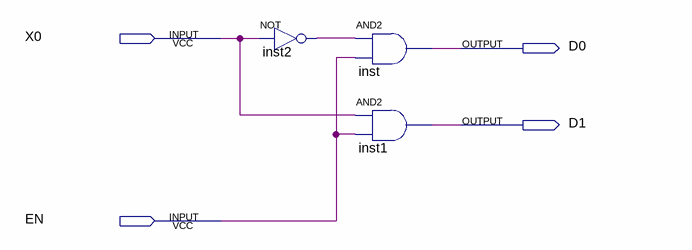
[diagram p0: schematic sheet]
// Quartus schematic DC2.bdf as structural Verilog: 3 symbols, 4 pins
module DC2 (
  input  X0,
  input  EN,
  output D0,
  output D1
);

  wire inst2_out;

  not inst2 (inst2_out, X0);
  and inst (D0, inst2_out, EN);
  and inst1 (D1, X0, EN);
endmodule
